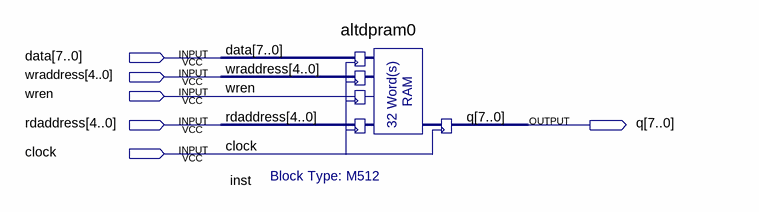
[diagram p0: schematic sheet]
// Quartus schematic TestRAM.bdf as structural Verilog: 1 symbols, 6 pins
module TestRAM (
  input  [7:0] data,
  input  [4:0] wraddress,
  input  wren,
  input  [4:0] rdaddress,
  input  clock,
  output [7:0] q
);

  altdpram0 inst (.data(data), .wraddress(wraddress), .wren(wren), .rdaddress(rdaddress), .clock(clock), .q(q));
endmodule
